# EAGLE schematic XTIDE-CPLD-3V3-v1b (EAGLE 5.07)
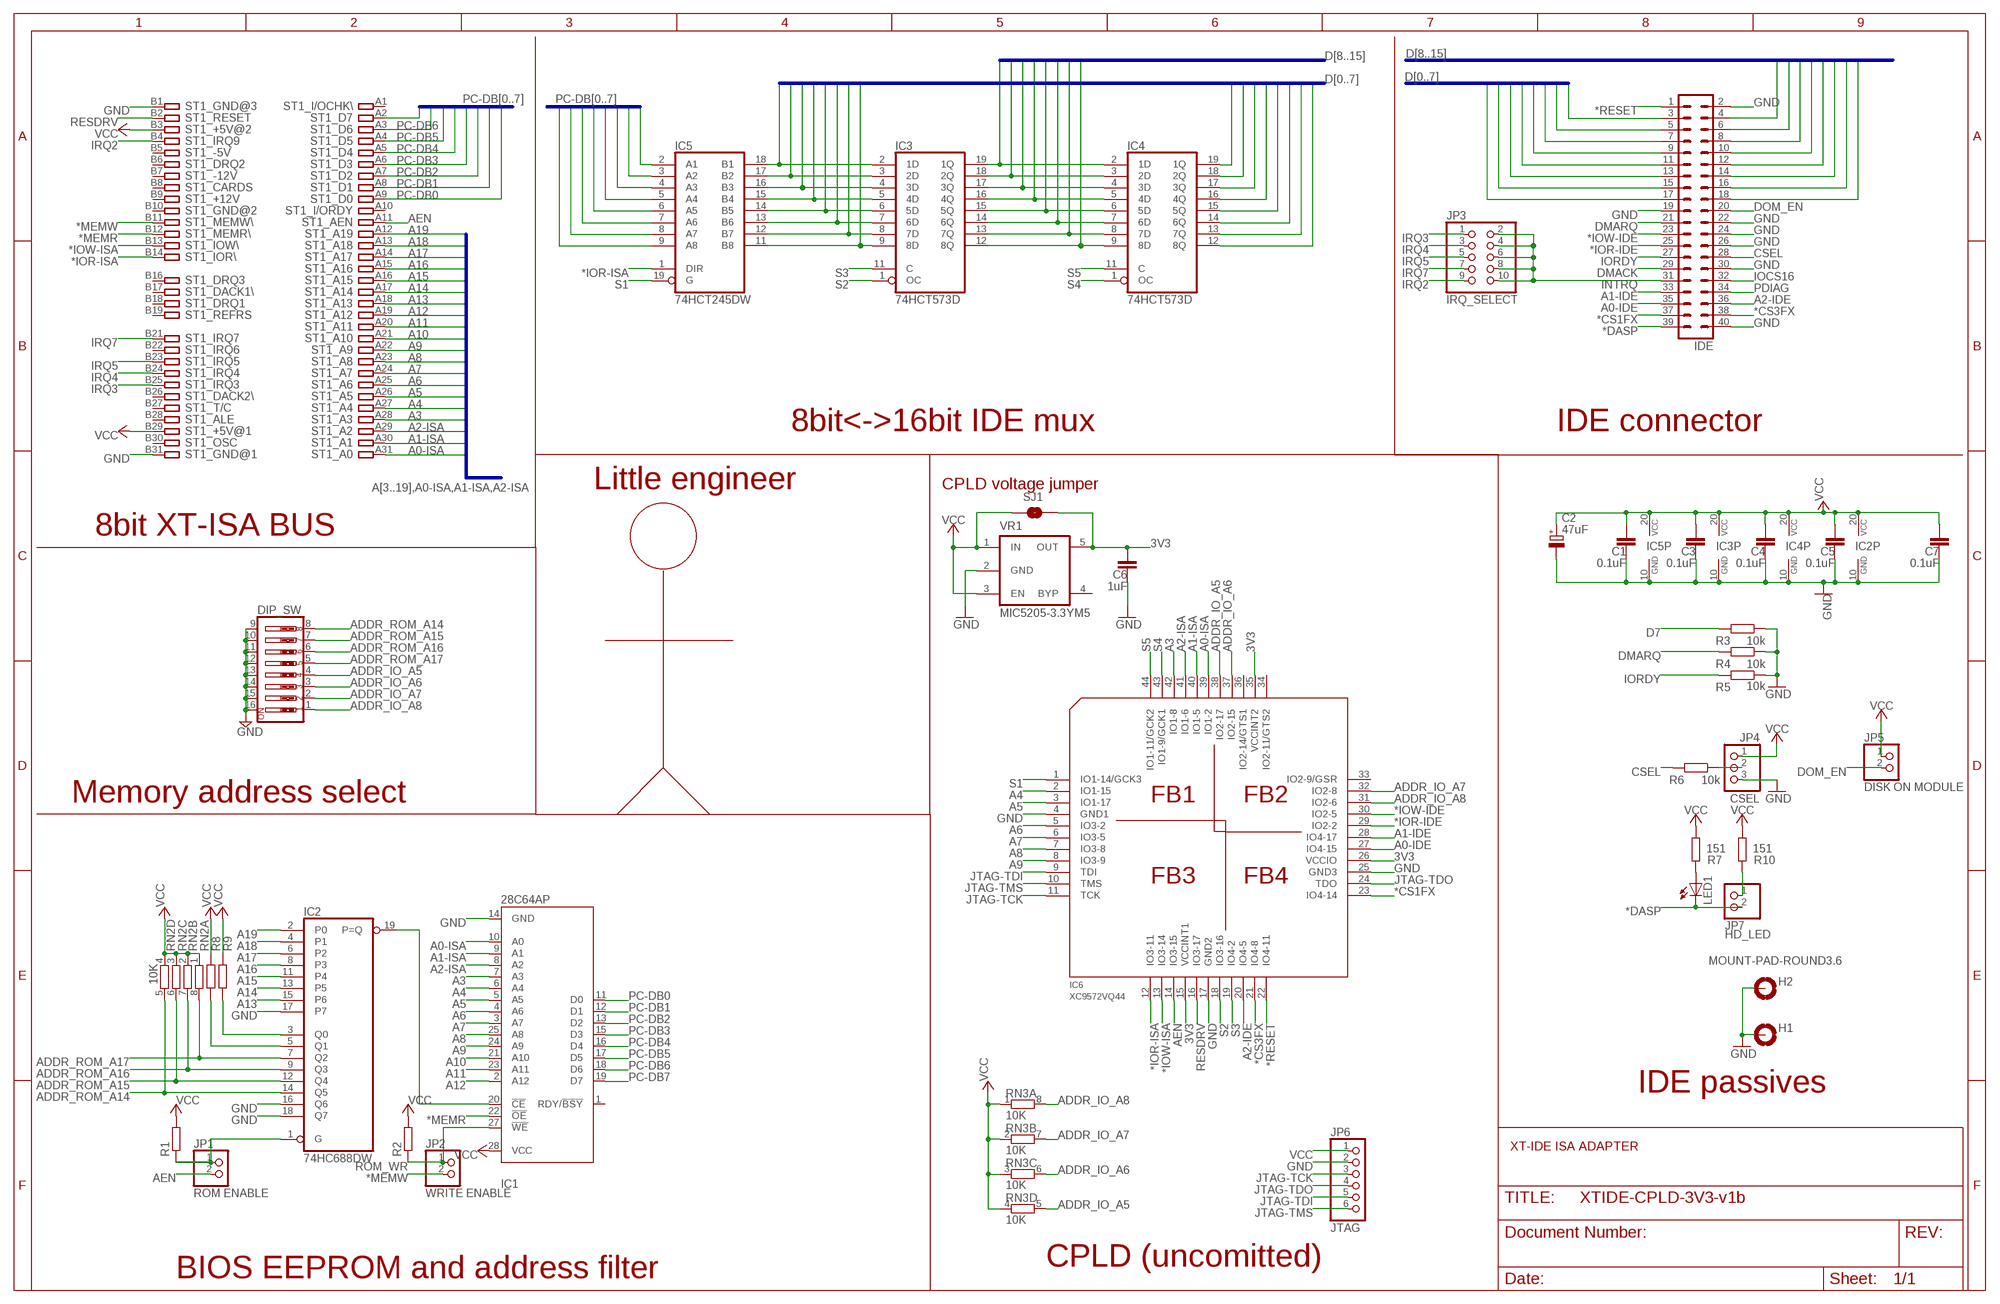
[diagram p0: schematic, sheet 1]

## Parts
C1  0.1uF  C-EUC0603  [C0603]
C2  47uF  CPOL-EUSANYO_SMD_A5  [SANYO-OSCON_SMD_A5]
C3  0.1uF  C-EUC0603  [C0603]
C4  0.1uF  C-EUC0603  [C0603]
C5  0.1uF  C-EUC0603  [C0603]
C6  1uF  C-EUC0603  [C0603]
C7  0.1uF  C-EUC0603  [C0603]
DIP_SW  SW_DIP-8  [EDG-08]
H1  MOUNT-PAD-ROUND3.6  [3,6-PAD]
H2  MOUNT-PAD-ROUND3.6  [3,6-PAD]
IC1  28C64AP  [DIL28-6]
IC2  74HC688DW  [SO20W]
IC3  74HCT573D  [SO20W]
IC4  74HCT573D  [SO20W]
IC5  74HCT245DW  [SO20W]
IC6  XC9572VQ44  [VQ44]
IDE  MA20-2  [MA20-2]
JP1  ROM ENABLE  PINHD-1X02_2.54-S  [1X02-S]
JP2  WRITE ENABLE  PINHD-1X02_2.54-S  [1X02-S]
JP3  IRQ_SELECT  PINHD-2X05_2.54  [2X05]
JP4  CSEL  PINHD-1X03_2.54-S  [1X03-S]
JP5  DISK ON MODULE  PINHD-1X02_2.54-S  [1X02-S]
JP6  JTAG  PINHD-1X06_2.54-S  [1X06-S]
JP7  HD_LED  PINHD-1X02_2.54-S  [1X02-S]
LED1  LEDCHIPLED_0805  [CHIPLED_0805]
R1  R-EU_R0603  [R0603]
R2  R-EU_R0603  [R0603]
R3  10k  R-EU_R0603  [R0603]
R4  10k  R-EU_R0603  [R0603]
R5  10k  R-EU_R0603  [R0603]
R6  10k  R-EU_R0603  [R0603]
R7  151  R-EU_R0603  [R0603]
R8  R-EU_R0603  [R0603]
R9  R-EU_R0603  [R0603]
R10  151  R-EU_R0603  [R0603]
RN2  10K  RNETWORK  [RN8P-4R-CRA06S]
RN3  10K  RNETWORK  [RN8P-4R-CRA06S]
SJ1  SOLDERJUMPERNC  [SJ-NC]
ST1  IBM8BIT  [IBM8BIT]
VR1  MIC5205-3.3YM5  MIC5205  [SOT-23-5]

## Nets
3V3: C6.2 IC6.15(VCCINT1) IC6.26(VCCIO) IC6.35(VCCINT2) SJ1.2 VR1.5(OUT)
*CS1FX: IC6.23(IO4-14) IDE.37
*CS3FX: IC6.21(IO4-8) IDE.38
*DASP: IDE.39 JP7.2 LED1.C
*IOR-IDE: IC6.29(IO2-2) IDE.25
*IOR-ISA: IC5.1(DIR) IC6.12(IO3-11) ST1.B14
*IOW-IDE: IC6.30(IO2-5) IDE.23
*IOW-ISA: IC6.13(IO3-14) ST1.B13
*MEMR: IC1.22(!OE) ST1.B12
*MEMW: JP2.2 ST1.B11
*RESET: IC6.22(IO4-11) IDE.1
A0-IDE: IC6.27(IO4-15) IDE.35
A0-ISA: IC1.10(A0) IC6.39(IO1-2) ST1.A31
A1-IDE: IC6.28(IO4-17) IDE.33
A1-ISA: IC1.9(A1) IC6.40(IO1-5) ST1.A30
A2-IDE: IC6.20(IO4-5) IDE.36
A2-ISA: IC1.8(A2) IC6.41(IO1-6) ST1.A29
A3: IC1.7(A3) IC6.42(IO1-8) ST1.A28
A4: IC1.6(A4) IC6.2(IO1-15) ST1.A27
A5: IC1.5(A5) IC6.3(IO1-17) ST1.A26
A6: IC1.4(A6) IC6.5(IO3-2) ST1.A25
A7: IC1.3(A7) IC6.6(IO3-5) ST1.A24
A8: IC1.25(A8) IC6.7(IO3-8) ST1.A23
A9: IC1.24(A9) IC6.8(IO3-9) ST1.A22
A10: IC1.21(A10) ST1.A21
A11: IC1.23(A11) ST1.A20
A12: IC1.2(A12) ST1.A19
A13: IC2.15(P6) ST1.A18
A14: IC2.13(P5) ST1.A17
A15: IC2.11(P4) ST1.A16
A16: IC2.8(P3) ST1.A15
A17: IC2.6(P2) ST1.A14
A18: IC2.4(P1) ST1.A13
A19: IC2.2(P0) ST1.A12
ADDR_IO_A5: DIP_SW.4 IC6.38(IO2-17) RN3.5
ADDR_IO_A6: DIP_SW.3 IC6.37(IO2-15) RN3.6
ADDR_IO_A7: DIP_SW.2 IC6.32(IO2-8) RN3.7
ADDR_IO_A8: DIP_SW.1 IC6.31(IO2-6) RN3.8
ADDR_ROM_A14: DIP_SW.8 IC2.14(Q5) RN2.5
ADDR_ROM_A15: DIP_SW.7 IC2.12(Q4) RN2.6
ADDR_ROM_A16: DIP_SW.6 IC2.9(Q3) RN2.7
ADDR_ROM_A17: DIP_SW.5 IC2.7(Q2) RN2.8
AEN: IC6.14(IO3-15) JP1.2 ST1.A11
CSEL: IDE.28 R6.2
D0: IC3.2(1D) IC4.19(1Q) IC5.18(B1) IDE.17
D1: IC3.3(2D) IC4.18(2Q) IC5.17(B2) IDE.15
D2: IC3.4(3D) IC4.17(3Q) IC5.16(B3) IDE.13
D3: IC3.5(4D) IC4.16(4Q) IC5.15(B4) IDE.11
D4: IC3.6(5D) IC4.15(5Q) IC5.14(B5) IDE.9
D5: IC3.7(6D) IC4.14(6Q) IC5.13(B6) IDE.7
D6: IC3.8(7D) IC4.13(7Q) IC5.12(B7) IDE.5
D7: IC3.9(8D) IC4.12(8Q) IC5.11(B8) IDE.3 R3.2
D8: IC3.19(1Q) IC4.2(1D) IDE.4
D9: IC3.18(2Q) IC4.3(2D) IDE.6
D10: IC3.17(3Q) IC4.4(3D) IDE.8
D11: IC3.16(4Q) IC4.5(4D) IDE.10
D12: IC3.15(5Q) IC4.6(5D) IDE.12
D13: IC3.14(6Q) IC4.7(6D) IDE.14
D14: IC3.13(7Q) IC4.8(7D) IDE.16
D15: IC3.12(8Q) IC4.9(8D) IDE.18
DMACK: IDE.29
DMARQ: IDE.21 R4.2
DOM_EN: IDE.20 JP5.2
GND: C1.1 C2.- C3.1 C4.1 C5.1 C6.1 C7.1 DIP_SW.9 DIP_SW.10 DIP_SW.11 DIP_SW.12 DIP_SW.13 DIP_SW.14 DIP_SW.15 DIP_SW.16 H1.B3,6(MOUNT) H2.B3,6(MOUNT) IC1.14(GND) IC2.10(GND) IC2.16(Q6) IC2.17(P7) IC2.18(Q7) IC3.10(GND) IC4.10(GND) IC5.10(GND) IC6.4(GND1) IC6.17(GND2) IC6.25(GND3) IDE.2 IDE.19 IDE.22 IDE.24 IDE.26 IDE.30 IDE.40 JP4.3 JP6.2 R3.1 R4.1 R5.1 ST1.B1 ST1.B31 VR1.2(GND)
INTRQ: IDE.31 JP3.2 JP3.4 JP3.6 JP3.8 JP3.10
IOCS16: IDE.32
IORDY: IDE.27 R5.2
IRQ2: JP3.9 ST1.B4
IRQ3: JP3.1 ST1.B25
IRQ4: JP3.3 ST1.B24
IRQ5: JP3.5 ST1.B23
IRQ7: JP3.7 ST1.B21
JTAG-TCK: IC6.11(TCK) JP6.3
JTAG-TDI: IC6.9(TDI) JP6.5
JTAG-TDO: IC6.24(TDO) JP6.4
JTAG-TMS: IC6.10(TMS) JP6.6
N$1: IC2.1(G) JP1.1 R1.1
N$2: IC2.3(Q0) R9.1
N$3: IC2.5(Q1) R8.1
N$4: JP4.2 R6.1
N$5: LED1.A R7.2
N$6: JP7.1 R10.2
PC-DB0: IC1.11(D0) IC5.2(A1) ST1.A9
PC-DB1: IC1.12(D1) IC5.3(A2) ST1.A8
PC-DB2: IC1.13(D2) IC5.4(A3) ST1.A7
PC-DB3: IC1.15(D3) IC5.5(A4) ST1.A6
PC-DB4: IC1.16(D4) IC5.6(A5) ST1.A5
PC-DB5: IC1.17(D5) IC5.7(A6) ST1.A4
PC-DB6: IC1.18(D6) IC5.8(A7) ST1.A3
PC-DB7: IC1.19(D7) IC5.9(A8) ST1.A2
PDIAG: IDE.34
RESDRV: IC6.16(IO3-17) ST1.B2
ROM_CS: IC1.20(!CE) IC2.19(P=Q)
ROM_WR: IC1.27(!WE) JP2.1 R2.1
S1: IC5.19(G) IC6.1(IO1-14/GCK3)
S2: IC3.1(OC) IC6.18(IO3-16)
S3: IC3.11(C) IC6.19(IO4-2)
S4: IC4.1(OC) IC6.43(IO1-9/GCK1)
S5: IC4.11(C) IC6.44(IO1-11/GCK2)
VCC: C1.2 C2.+ C3.2 C4.2 C5.2 C7.2 IC1.28(VCC) IC2.20(VCC) IC3.20(VCC) IC4.20(VCC) IC5.20(VCC) JP4.1 JP5.1 JP6.1 R1.2 R2.2 R7.1 R8.2 R9.2 R10.1 RN2.1 RN2.2 RN2.3 RN2.4 RN3.1 RN3.2 RN3.3 RN3.4 SJ1.1 ST1.B3 ST1.B29 VR1.1(IN) VR1.3(EN)
Unconnected: IC1.1(RDY/!BSY) IC6.33(IO2-9/GSR) IC6.34(IO2-11/GTS2) IC6.36(IO2-14/GTS1) ST1.A1 ST1.A10 ST1.B5 ST1.B6 ST1.B7 ST1.B8 ST1.B9 ST1.B10 ST1.B15 ST1.B16 ST1.B17 ST1.B18 ST1.B19 ST1.B20 ST1.B22 ST1.B26 ST1.B27 ST1.B28 ST1.B30 VR1.4(BYP)

## Buses
D[0..7]
D[8..15]
PC-DB[0..7]
A[3..19],A0-ISA,A1-ISA,A2-ISA

## Notes on the sheet
- 8bit<->16bit IDE mux | IDE connector
- Little engineer | CPLD voltage jumper
- 8bit XT-ISA BUS
- Memory address select
- IDE passives
- XT-IDE ISA ADAPTER
- CPLD (uncomitted)
- BIOS EEPROM and address filter

## Library data of the parts
C1 C3-C7 = rcl:C-EU: CAPACITOR, European symbol
C2 = rcl:CPOL-EU: POLARIZED CAPACITOR, European symbol
DIP_SW = special:SW_DIP-8: DIP SWITCH
H1 H2 = holes:MOUNT-PAD-ROUND: MOUNTING PAD, round
IC1 = microchip:28*64A: CMOS EEPROM 64 K (8 K x 8), low voltage
IC2 = 74xx-eu:74*688: 8-bit MAGNITUDE/IDENTITY COMPARATOR, totem pole
IC3 IC4 = 74xx-eu:74*573: 8-bit D latch BUS DRIVER
IC5 = 74xx-eu:74*245: Octal BUS TRANSCEIVER, 3-state
IC6 = dp_devices:XC9572
IDE = con-lstb:MA20-2: PIN HEADER
JP1 JP2 JP5 JP7 = pinhead-2:PINHD-1X02: PIN HEADER
JP3 = pinhead-2:PINHD-2X05: PIN HEADER
JP4 = pinhead-2:PINHD-1X03: PIN HEADER
JP6 = pinhead-2:PINHD-1X06: PIN HEADER
LED1 = led:LED: LED OSRAM: - CHIPLED LG R971, LG N971, LY N971, LG Q971, LY Q971, LO R971, LY R971 LH N974, LH R974 LS Q976, LO Q976, LY Q976 LO Q996 - Hyper CHIPLED LW Q18S LB Q993, LB Q99A, LB R99A - SideLED LS A670, LO A670, LY A670, LG A670, LP A670 LB A673, LV A673, LT A673, LW A673 LH A674 LY A675 LS A676, LA A676, LO A676, LY A676, LW A676 LS A679, LY A679, LG A679 - Hyper Micro SIDELED® LS Y876, LA Y876, LO Y876, LY Y876 LT Y87S - SmartLED LW L88C, LW L88S LB L89C, LB L89S, LG L890 LS L89K, LO L89K, LY L89K LS L896, LA L896, LO L896, LY L896 - TOPLED LS T670, LO T670, LY T670, LG T670, LP T670 LSG T670, LSP T670, LSY T670, LOP T670, LYG T670 LG T671, LOG T671, LSG T671 LB T673, LV T673, LT T673, LW T673 LH T674 LS T676, LA T676, LO T676, LY T676, LB T676, LH T676, LSB T676, LW T676 LB T67C, LV T67C, LT T67C, LS T67K, LO T67K, LY T67K, LW E67C LS E67B, LA E67B, LO E67B, LY E67B, LB E67C, LV E67C, LT E67C LW T67C LS T679, LY T679, LG T679 LS T770, LO T770, LY T770, LG T770, LP T770 LB T773, LV T773, LT T773, LW T773 LH T774 LS E675, LA E675, LY E675, LS T675 LS T776, LA T776, LO T776, LY T776, LB T776 LHGB T686 LT T68C, LB T68C - Hyper Mini TOPLED® LB M676 - Mini TOPLED Santana® LG M470 LS M47K, LO M47K, LY M47K Source: http://www.osram.convergy.de LUXEON: - LUMILED® LXK2-PW12-R00, LXK2-PW12-S00, LXK2-PW14-U00, LXK2-PW14-V00 LXK2-PM12-R00, LXK2-PM12-S00, LXK2-PM14-U00 LXK2-PE12-Q00, LXK2-PE12-R00, LXK2-PE12-S00, LXK2-PE14-T00, LXK2-PE14-U00 LXK2-PB12-K00, LXK2-PB12-L00, LXK2-PB12-M00, LXK2-PB14-N00, LXK2-PB14-P00, LXK2-PB14-Q00 LXK2-PR12-L00, LXK2-PR12-M00, LXK2-PR14-Q00, LXK2-PR14-R00 LXK2-PD12-Q00, LXK2-PD12-R00, LXK2-PD12-S00 LXK2-PH12-R00, LXK2-PH12-S00 LXK2-PL12-P00, LXK2-PL12-Q00, LXK2-PL12-R00 Source: www.luxeon.com KINGBRIGHT: KA-3528ASYC Source: www.kingbright.com
R1-R10 = rcl:R-EU_: RESISTOR, European symbol
RN2 RN3 = dp_devices:RNETWORK: 4 Resistor Array 0603
SJ1 = SparkFun-3-2-07:SOLDERJUMPER: Solder Jumper Standard SMD solder jumper. Used to automate production. Two varients : Normally Open and Normally Closed are the same, but have different paste layers. NC will have a large amount of paste and should jumper during reflow.
ST1 = con-pc:IBM8BIT: 8-bit CARD IBM/PC-AT
VR1 = dp_devices:MIC5205: 150ma Low-Noise LDO Regulator